# Altium schematic sheet EVB-ANNA-B5_SCHEM_0005_On-Board-Debug.SchDoc
size A3; DocumentNumber: 5; SheetNumber: 6; SheetTotal: 8
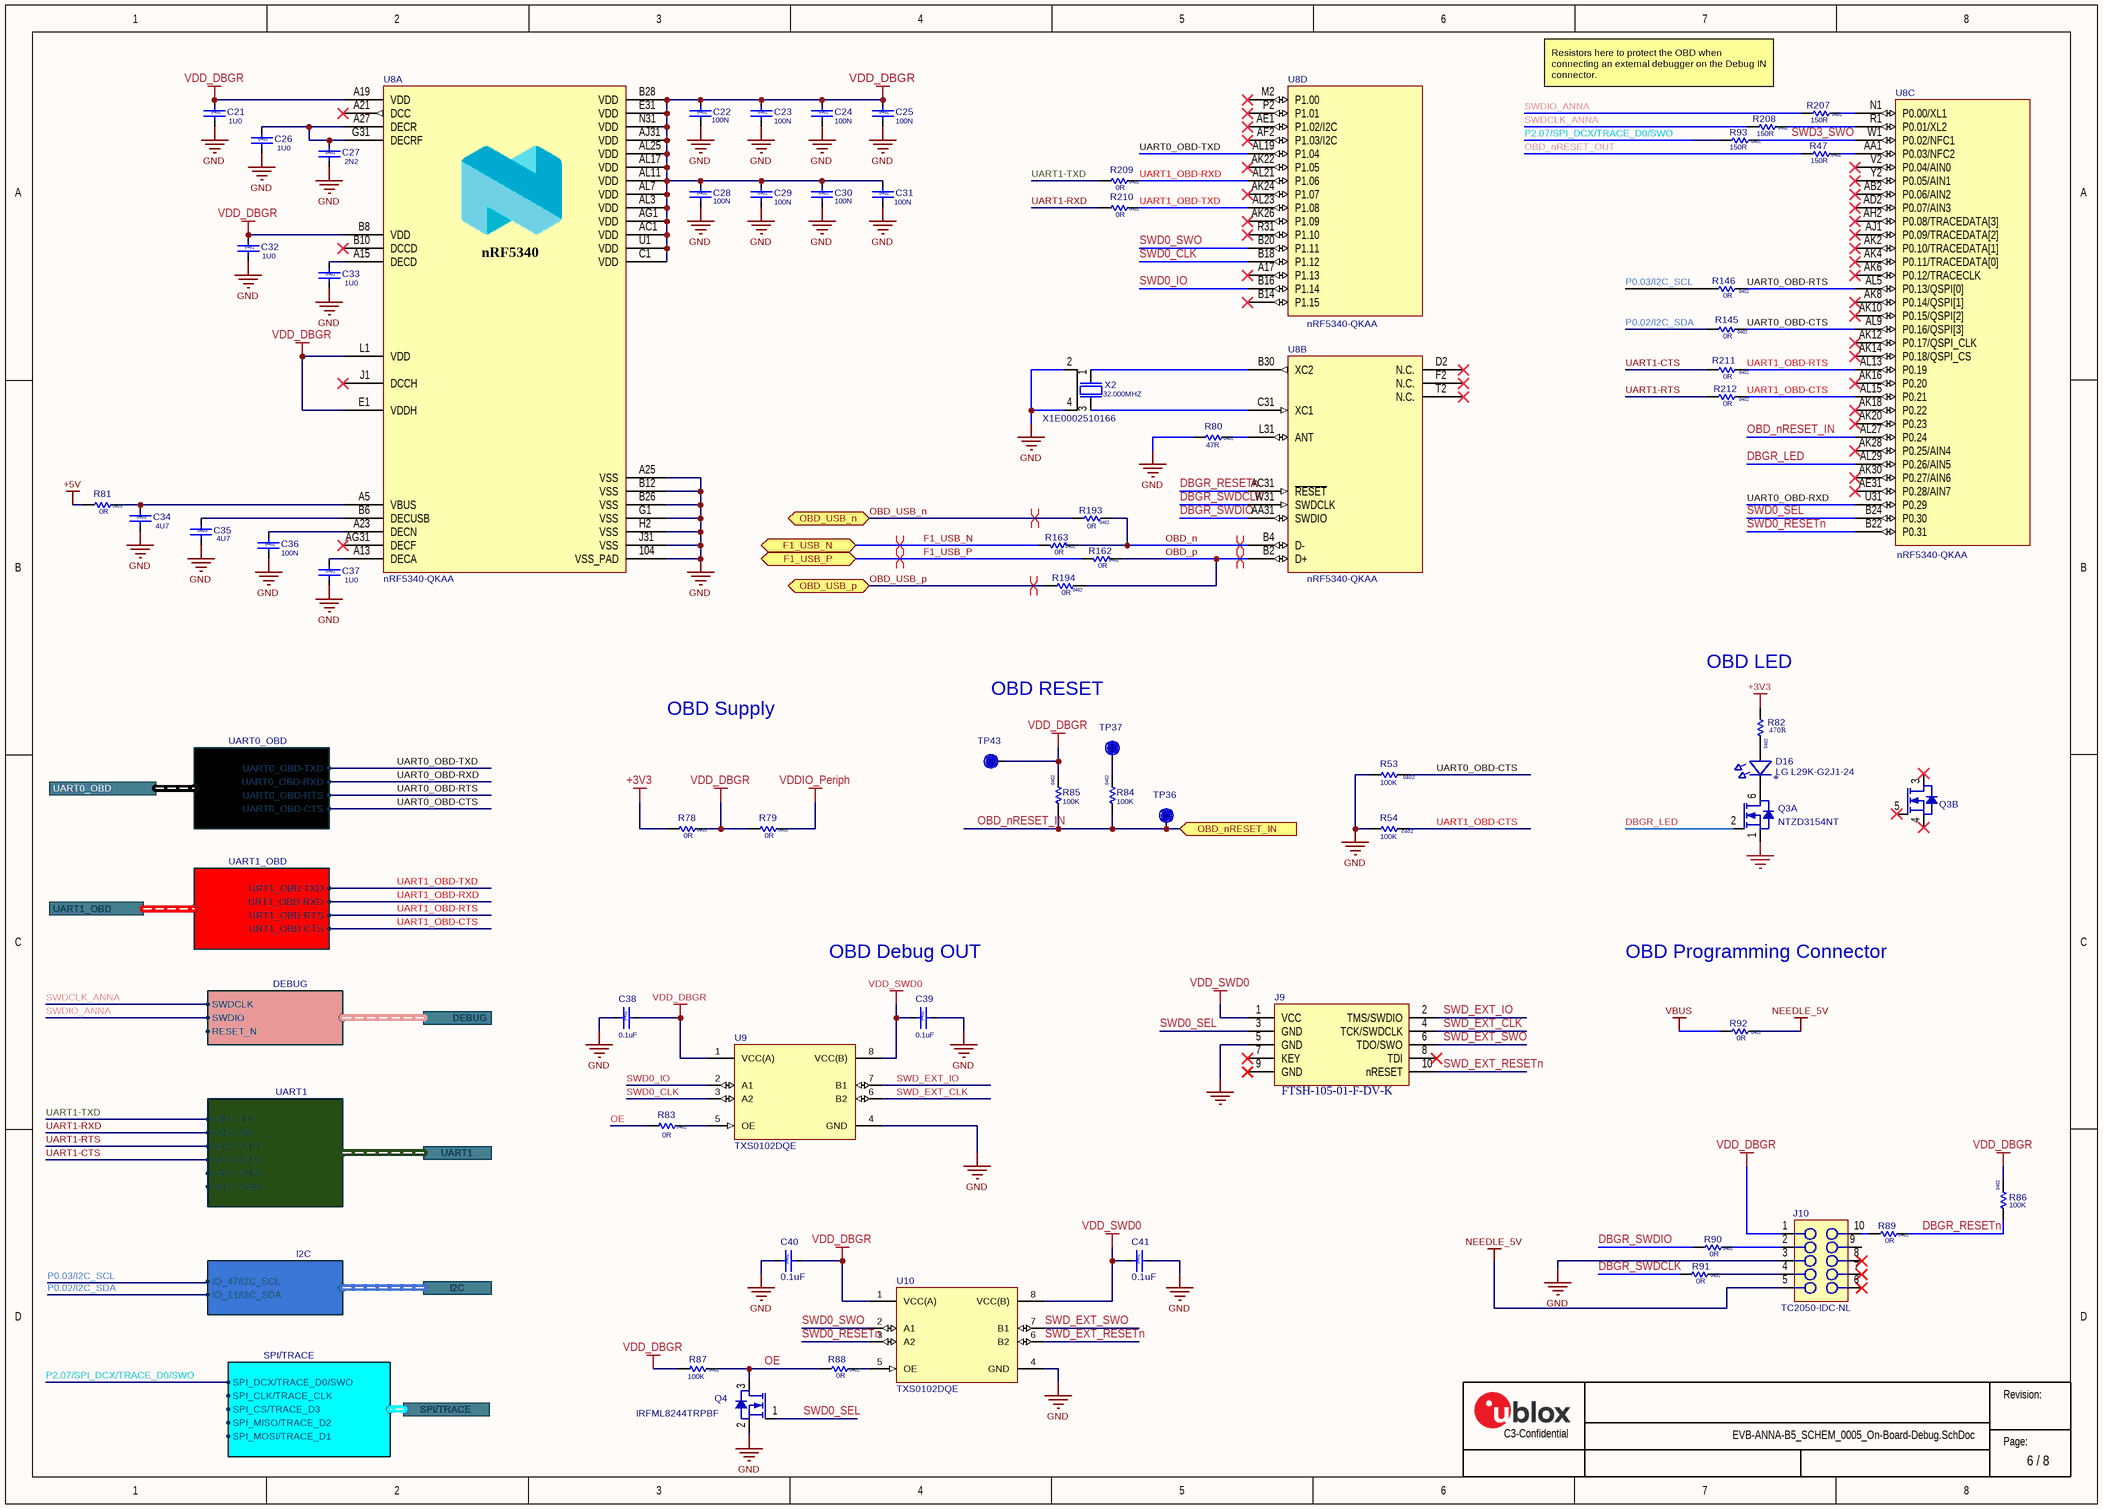
[diagram p0: EVB-ANNA-B5_SCHEM_0005_On-Board-Debug.SchDoc]

## Parts
C21  value 1U0  Size: 0402  [Cap_0402_1100Lx600Wx600H_600x600Pad_350G_FLX]  (hidden comment: UBXH01-2021003)
C22  value 100N  Size: 0402  [Cap 0402 HD]  (hidden comment: UBXH01-2021002)
C23  value 100N  Size: 0402  [Cap 0402 HD]  (hidden comment: UBXH01-2021002)
C24  value 100N  Size: 0402  [Cap 0402 HD]  (hidden comment: UBXH01-2021002)
C25  value 100N  Size: 0402  [Cap 0402 HD]  (hidden comment: UBXH01-2021002)
C26  value 1U0  Size: 0402  [Cap_0402_1100Lx600Wx600H_600x600Pad_350G_FLX]  (hidden comment: UBXH01-2021003)
C27  value 2N2  Size: 0402  [Cap_0402_1100Lx600Wx600H_600x600Pad_350G_FLX]  (hidden comment: UBXH01-0023017)
C28  value 100N  Size: 0402  [Cap 0402 HD]  (hidden comment: UBXH01-2021002)
C29  value 100N  Size: 0402  [Cap 0402 HD]  (hidden comment: UBXH01-2021002)
C30  value 100N  Size: 0402  [Cap 0402 HD]  (hidden comment: UBXH01-2021002)
C31  value 100N  Size: 0402  [Cap 0402 HD]  (hidden comment: UBXH01-2021002)
C32  value 1U0  Size: 0402  [Cap_0402_1100Lx600Wx600H_600x600Pad_350G_FLX]  (hidden comment: UBXH01-2021003)
C33  value 1U0  Size: 0402  [Cap_0402_1100Lx600Wx600H_600x600Pad_350G_FLX]  (hidden comment: UBXH01-2021003)
C34  value 4U7  Size: 0603  [CAP_0603_1750Lx950Wx850H_600x1000Pad_900G_FLX]  (hidden comment: UBXH01-2002003)
C35  value 4U7  Size: 0603  [CAP_0603_1750Lx950Wx850H_600x1000Pad_900G_FLX]  (hidden comment: UBXH01-2002003)
C36  value 100N  Size: 0402  [Cap 0402 HD]  (hidden comment: UBXH01-2021002)
C37  value 1U0  Size: 0402  [Cap_0402_1100Lx600Wx600H_600x600Pad_350G_FLX]  (hidden comment: UBXH01-2021003)
C38  value 0.1uF  Size: 0402  [Cap 0402 HD]  (hidden comment: 120-00016)
C39  value 0.1uF  Size: 0402  [Cap 0402 HD]  (hidden comment: 120-00016)
C40  value 0.1uF  Size: 0402  [Cap 0402 HD]  (hidden comment: 120-00016)
C41  value 0.1uF  Size: 0402  [Cap 0402 HD]  (hidden comment: 120-00016)
D16  Manufacturer P/N: LG L29K-G2J1-24  [LED_0603_1600Lx800Wx400H_600x800Pad_800G_FLX]  (hidden comment: UBXH11-0000018)
J9  Manufacturer P/N: FTSH-105-01-F-DV-K  [HDR.050P-10Pin-2x5-SMT_Key]  (hidden comment: 130-00099)
J10  TC2050-IDC-NL  [TC2050-IDC-NL]  (no BOM)
Q3  value NTZD3154NT  [SOT-563]  (hidden comment: UBXH20-0000083)  (parts A,B of 2)
Q4  value IRFML8244TRPBF  [SOT-23]  (hidden comment: UBXH20-0000036)
R47  value 150R  Size: 0402  [RES_0402_1100Lx600Wx400H_500x600Pad_400G_FLX]  (hidden comment: UBXH18-0008029)
R53  value 100K  Size: 0402  [RES 0402 HD]  (hidden comment: UBXH18-0000005)
R54  value 100K  Size: 0402  [RES 0402 HD]  (hidden comment: UBXH18-0000005)
R78  value 0R  Size: 0603  [RES_0603_1700Lx950Wx600H_600x1000Pad_800G_FLX]  (hidden comment: UBXH18-0003001)
R79  value 0R  Size: 0603  [RES_0603_1700Lx950Wx600H_600x1000Pad_800G_FLX]  (hidden comment: UBXH18-0003001)
R80  value 47R  Size: 0402  [RES_0402_1100Lx600Wx400H_500x600Pad_400G_FLX]  (hidden comment: UBXH18-0008017)
R81  value 0R  Size: 0603  [RES_0603_1700Lx950Wx600H_600x1000Pad_800G_FLX]  (hidden comment: UBXH18-0003001)
R82  value 470R  Size: 0402  [RES_0402_1100Lx600Wx400H_500x600Pad_400G_FLX]  (hidden comment: UBXH18-0008041)
R83  value 0R  Size: 0402  [RES 0402 HD]  (hidden comment: UBXH18-0003002)
R84  value 100K  Size: 0402  [RES 0402 HD]  (hidden comment: UBXH18-0000005)
R85  value 100K  Size: 0402  [RES 0402 HD]  (hidden comment: UBXH18-0000005)
R86  value 100K  Size: 0402  [RES 0402 HD]  (hidden comment: UBXH18-0000005)
R87  value 100K  Size: 0402  [RES 0402 HD]  (hidden comment: UBXH18-0000005)
R88  value 0R  Size: 0402  [RES 0402 HD]  (hidden comment: UBXH18-0003002)
R89  value 0R  Size: 0402  [RES 0402 HD]  (hidden comment: UBXH18-0003002)
R90  value 0R  Size: 0402  [RES 0402 HD]  (hidden comment: UBXH18-0003002)
R91  value 0R  Size: 0402  [RES 0402 HD]  (hidden comment: UBXH18-0003002)
R92  value 0R  Size: 0402  [RES 0402 HD]  (hidden comment: UBXH18-0003002)
R93  value 150R  Size: 0402  [RES_0402_1100Lx600Wx400H_500x600Pad_400G_FLX]  (hidden comment: UBXH18-0008029)
R145  value 0R  Size: 0402  [RES 0402 HD]  (hidden comment: UBXH18-0003002)
R146  value 0R  Size: 0402  [RES 0402 HD]  (hidden comment: UBXH18-0003002)
R162  value 0R  Size: 0402  [RES 0402 HD]  (hidden comment: UBXH18-0003002)
R163  value 0R  Size: 0402  [RES 0402 HD]  (hidden comment: UBXH18-0003002)
R193  value 0R  Size: 0402  [RES 0402 HD]  (hidden comment: UBXH18-0003002)
R194  value 0R  Size: 0402  [RES 0402 HD]  (hidden comment: UBXH18-0003002)
R207  value 150R  Size: 0402  [RES_0402_1100Lx600Wx400H_500x600Pad_400G_FLX]  (hidden comment: UBXH18-0008029)
R208  value 150R  Size: 0402  [RES_0402_1100Lx600Wx400H_500x600Pad_400G_FLX]  (hidden comment: UBXH18-0008029)
R209  value 0R  Size: 0402  [RES 0402 HD]  (hidden comment: UBXH18-0003002)
R210  value 0R  Size: 0402  [RES 0402 HD]  (hidden comment: UBXH18-0003002)
R211  value 0R  Size: 0402  [RES 0402 HD]  (hidden comment: UBXH18-0003002)
R212  value 0R  Size: 0402  [RES 0402 HD]  (hidden comment: UBXH18-0003002)
TP36  TP10R  [TP10R]  (value not drawn)  (no BOM)
TP37  TP10R  [TP10R]  (value not drawn)  (no BOM)
TP43  TP10R  [TP10R]  (value not drawn)  (no BOM)
U8  Manufacturer P/N: nRF5340-QKAA  [nRF5340_AQFN94]  (hidden comment: UBXH12-0000420)  (parts A,B,C,D of 4)
U9  value TXS0102DQE  [DQE0008A]  (hidden comment: UBXH10-0000108)
U10  value TXS0102DQE  [DQE0008A]  (hidden comment: UBXH10-0000108)
X2  value 32.000MHZ  Manufacturer P/N: X1E0002510166  [XTAL_1612]  (hidden comment: UBXH21-0000240)

## Ports
DEBUG (harness Debug), F1_USB_N (bidir), F1_USB_P (bidir), I2C (harness I2C), OBD_nRESET_IN (in), OBD_USB_n (bidir), OBD_USB_p (bidir), SPI/TRACE (harness SPI/TRACE), UART0_OBD (harness UART0_OBD), UART1 (harness UART1), UART1_OBD (harness UART1_OBD)

## Harnesses
UART1_OBD: URT1_OBD-RTS, URT1_OBD-CTS, URT1_OBD-TXD, URT1_OBD-RXD
UART0_OBD: UART0_OBD-TXD, UART0_OBD-RXD, UART0_OBD-RTS, UART0_OBD-CTS
DEBUG: RESET_N, SWDIO, SWDCLK
UART1: URT1-RTS, URT1-CTS, URT1-TX, URT1-RX, URT1-DTR, URT1-DSR
SPI/TRACE: SPI_DCX/TRACE_D0/SWO, SPI_CLK/TRACE_CLK, SPI_CS/TRACE_D3, SPI_MISO/TRACE_D2, SPI_MOSI/TRACE_D1
I2C: IO_47/I2C_SCL, IO_11/I2C_SDA

## Nets
+3V3: R78.1 R82.1
+5V: R81.1
GND: C21.2 C22.2 C23.2 C24.2 C25.2 C26.2 C27.2 C28.2 C29.2 C30.2 C31.2 C32.2 C33.2 C34.2 C35.2 C36.2 C37.2 C38.1 C39.2 C40.1 C41.2 J9.5(GND) J10.3 Q3.1(S1) Q4.2(S) R53.1 R54.1 R80.1 U8.104(VSS_PAD) U8.A25(VSS) U8.B12(VSS) U8.B26(VSS) U8.G1(VSS) U8.H2(VSS) U8.J31(VSS) U9.4(GND) U10.4(GND) X2.2 X2.4
NEEDLE_5V: J10.5 R92.1
VBUS: R92.2
VDD_DBGR: C21.1 C22.1 C23.1 C24.1 C25.1 C28.1 C29.1 C30.1 C31.1 C32.1 C38.2 C40.2 J10.1 R78.2 R79.1 R85.2 R86.2 R87.2 TP43.1 U8.A19(VDD) U8.AC1(VDD) U8.AG1(VDD) U8.AJ31(VDD) U8.AL3(VDD) U8.AL7(VDD) U8.AL11(VDD) U8.AL17(VDD) U8.AL25(VDD) U8.B8(VDD) U8.B28(VDD) U8.C1(VDD) U8.E1(VDDH) U8.E31(VDD) U8.L1(VDD) U8.N31(VDD) U8.U1(VDD) U9.1(VCC(A)) U10.1(VCC(A))
VDD_SWD0: C39.1 C41.1 J9.1(VCC) U9.8(VCC(B)) U10.8(VCC(B))
VDDIO_Periph: R79.2
DBGR_LED: Q3.2(G1) U8.AL29(P0.26/AIN5)
DBGR_RESETn: R86.1 R89.1 U8.AC31(~{RESET})
DBGR_SWDCLK: R91.2 U8.W31(SWDCLK)
DBGR_SWDIO: R90.2 U8.AA31(SWDIO)
F1_USB_N: R163.2 ; port F1_USB_N
F1_USB_P: R162.2 ; port F1_USB_P
OBD_n: R163.1 R193.1 U8.B4(D-)
OBD_nRESET_IN: R84.1 R85.1 TP36.1 U8.AL27(P0.24) ; port OBD_nRESET_IN
OBD_nRESET_OUT: R47.1
OBD_p: R162.1 R194.1 U8.B2(D+)
OBD_USB_n: R193.2 ; port OBD_USB_n
OBD_USB_p: R194.2 ; port OBD_USB_p
OE: Q4.3(D) R83.2 R87.1 R88.1
P0.02/I2C_SDA: R145.2 ; port I2C.IO_11/I2C_SDA
P0.03/I2C_SCL: R146.2 ; port I2C.IO_47/I2C_SCL
P2.07/SPI_DCX/TRACE_D0/SWO: R93.1 ; port SPI/TRACE.SPI_DCX/TRACE_D0/SWO
SWD0_CLK: U8.B18(P1.12) U9.3(A2)
SWD0_IO: U8.B16(P1.14) U9.2(A1)
SWD0_RESETn: U8.B22(P0.31) U10.3(A2)
SWD0_SEL: J9.3(GND) Q4.1(G) U8.B24(P0.30)
SWD0_SWO: U8.B20(P1.11) U10.2(A1)
SWD3_SWO: R93.2 U8.W1(P0.02/NFC1)
SWD_EXT_CLK: J9.4(TCK/SWDCLK) U9.6(B2)
SWD_EXT_IO: J9.2(TMS/SWDIO) U9.7(B1)
SWD_EXT_RESETn: J9.10(nRESET) U10.6(B2)
SWD_EXT_SWO: J9.6(TDO/SWO) U10.7(B1)
SWDCLK_ANNA: R208.1 ; port DEBUG.SWDCLK
SWDIO_ANNA: R207.1 ; port DEBUG.SWDIO
UART0_OBD-CTS: R53.2 R145.1 U8.AL9(P0.16/QSPI[3]) ; port UART0_OBD.UART0_OBD-CTS
UART0_OBD-RTS: R146.1 U8.AL5(P0.13/QSPI[0]) ; port UART0_OBD.UART0_OBD-RTS
UART0_OBD-RXD: U8.U31(P0.29) ; port UART0_OBD.UART0_OBD-RXD
UART0_OBD-TXD: U8.AL19(P1.04) ; port UART0_OBD.UART0_OBD-TXD
UART1-CTS: R211.2 ; port UART1.URT1-CTS
UART1-RTS: R212.2 ; port UART1.URT1-RTS
UART1-RXD: R210.2 ; port UART1.URT1-RX
UART1-TXD: R209.2 ; port UART1.URT1-TX
UART1_OBD-CTS: R54.2 R212.1 U8.AL15(P0.21) ; port UART1_OBD.URT1_OBD-CTS
UART1_OBD-RTS: R211.1 U8.AL13(P0.19) ; port UART1_OBD.URT1_OBD-RTS
UART1_OBD-RXD: R209.1 U8.AL21(P1.06) ; port UART1_OBD.URT1_OBD-RXD
UART1_OBD-TXD: R210.1 U8.AL23(P1.08) ; port UART1_OBD.URT1_OBD-TXD
NetC26_1: C26.1 C27.1 U8.A27(DECR) U8.G31(DECRF)
NetC33_1: C33.1 U8.A15(DECD)
NetC34_1: C34.1 R81.2 U8.A5(VBUS)
NetC35_1: C35.1 U8.B6(DECUSB)
NetC36_1: C36.1 U8.A23(DECN)
NetC37_1: C37.1 U8.A13(DECA)
NetD16_1: D16.1(C) Q3.6(D1)
NetD16_2: D16.2(A) R82.2
NetJ10_2: J10.2 R90.1
NetJ10_4: J10.4 R91.1
NetJ10_10: J10.10 R89.2
NetR47_2: R47.2 U8.AA1(P0.03/NFC2)
NetR80_2: R80.2 U8.L31(ANT)
NetR83_1: R83.1 U9.5(OE)
NetR84_2: R84.2 TP37.1
NetR88_2: R88.2 U10.5(OE)
NetR207_2: R207.2 U8.N1(P0.00/XL1)
NetR208_2: R208.2 U8.R1(P0.01/XL2)
NetU8_B30: U8.B30(XC2) X2.1
NetU8_C31: U8.C31(XC1) X2.3

Not connected (* = marked no-connect by the designer): J9 7(KEY)* 8(TDI)* 9(GND)*; J10 6* 7* 8* 9; Q3 3(D2)* 4(S2)* 5(G2)*; U8 A17(P1.13)* A21(DCC)* AB2(P0.06/AIN2)* AD2(P0.07/AIN3)* AE1(P1.02/I2C)* AE31(P0.28/AIN7)* AF2(P1.03/I2C)* AG31(DECF)* AH2(P0.08/TRACEDATA[3])* AJ1(P0.09/TRACEDATA[2])* AK2(P0.10/TRACEDATA[1])* AK4(P0.11/TRACEDATA[0])* AK6(P0.12/TRACECLK)* AK8(P0.14/QSPI[1])* AK10(P0.15/QSPI[2])* AK12(P0.17/QSPI_CLK)* AK14(P0.18/QSPI_CS)* AK16(P0.20)* AK18(P0.22)* AK20(P0.23)* AK22(P1.05)* AK24(P1.07)* AK26(P1.09)* AK28(P0.25/AIN4)* AK30(P0.27/AIN6)* B10(DCCD)* B14(P1.15)* D2(N.C.)* F2(N.C.)* J1(DCCH)* M2(P1.00)* P2(P1.01)* R31(P1.10)* T2(N.C.)* V2(P0.04/AIN0)* Y2(P0.05/AIN1)*

## Layout directives
differential pair; net class USB_DIFF: F1_USB_N, F1_USB_P
differential pair: OBD_n, OBD_p, OBD_USB_n, OBD_USB_p

## Notes on the sheet
- Resistors here to protect the OBD when connecting an external debugger on the Debug IN connector.
- OBD Supply
- OBD RESET
- (near R82) OBD LED
- OBD Debug OUT
- OBD Programming Connector
- Revision:
- C3-Confidential
- Page:
- (in symbol UBXH12-0000420, part A) nRF5340

## Library data of the parts
C21 C26 C32 C33 C37 = UBXH01-2021003: CAP CER X5R 0402 1U0 10% 6.3V; Manufacturer: Murata Manufacturing Company, Ltd.; Manufacturer P/N: GRM155R61C105KA12; Editor: philippe.largier; Released by: alvaro.nussbaum; Env: GREEN; Permitted Use: Volume Products; Perferred: PREF; Mfg P/N Status: Active; Mfg P/N Split: 100; Mfg P/N Released: Yes; Part Number: UBXH01-2021003; Tolerance: 10%; Max Voltage: 6.3V; Part Type: Capacitor; Release Data: 2016-02-02T16:25:07; UBX Wiki: https://wiki.u-blox.com/bin/view/Operations/PartDetails?index=5761; RefDes: C; Mfg P/N Datasheet: https://wiki.u-blox.com/bin/view/Generic/Docs/DocumentSummary?index=29581; Manufacturer 2: Samsung Electro-Mechanics; Manufacturer P/N 2: CL05A105KA5NNN; Mfg P/N Status 2: Active; Mfg P/N Split 2: 0; Mfg P/N Released 2: Yes; Mfg P/N Datasheet 2: https://wiki.u-blox.com/bin/view/Generic/Docs/DocumentSummary?index=28197; Manufacturer 3: Taiyo Yuden Company, Ltd.; Manufacturer P/N 3: JMK105BJ105KV-F; Mfg P/N Status 3: NRND; Mfg P/N Split 3: 0; Mfg P/N Released 3: Yes; Mfg P/N Datasheet 3: https://wiki.u-blox.com/bin/view/Generic/Docs/DocumentSummary?index=20234
C22-C25 C28-C31 C36 = UBXH01-2021002: CAP CER X5R 0402 100N 10% 10V; Manufacturer: Murata Manufacturing Company, Ltd.; Manufacturer P/N: GRM155R61A104KA01; Editor: roland.rust; Env: GREEN; Permitted Use: Volume Products; Perferred: PREF; Mfg P/N Status: NRND; Mfg P/N Split: 100; Mfg P/N Released: Yes; Part Number: UBXH01-2021002; Tolerance: 10%; Max Voltage: 10V; Part Type: Capacitor; Released by: roland.rust; Release Data: 2005-07-22T13:59:44; UBX Wiki: https://wiki.u-blox.com/bin/view/Operations/PartDetails?index=5759; RefDes: C; Manufacturer 2: Samsung Electro-Mechanics; Manufacturer P/N 2: CL05A104KP5NNN; Mfg P/N Status 2: Active; Mfg P/N Split 2: 0; Mfg P/N Released 2: Yes; Mfg P/N Datasheet 2: https://wiki.u-blox.com/bin/view/Generic/Docs/DocumentSummary?index=28113
C27 = UBXH01-0023017: CAP CER X7R 0402 2N2 10% 16V; Manufacturer: Murata Manufacturing Company, Ltd.; Manufacturer P/N: GRM155R71C222KA01; Editor: roland.rust; Env: ROHS; Permitted Use: Volume Products; Perferred: PREF; Mfg P/N Status: NRND; Mfg P/N Split: 100; Mfg P/N Released: Yes; Part Number: UBXH01-0023017; Tolerance: 10%; Max Voltage: 16V; Part Type: Capacitor; Released by: roland.rust; Release Data: 2005-07-22T13:59:44; UBX Wiki: https://wiki.u-blox.com/bin/view/Operations/PartDetails?index=5475; RefDes: C
C34 C35 = UBXH01-2002003: CAP CER X5R 0603 4U7 10% 6.3V; Manufacturer: Murata Manufacturing Company, Ltd.; Manufacturer P/N: GRM188R61C475KE11; Editor: philippe.largier; Released by: roland.rust; Env: GREEN; Permitted Use: Volume Products; Perferred: PREF; Mfg P/N Status: Active; Mfg P/N Split: 100; Mfg P/N Released: Yes; Part Number: UBXH01-2002003; Tolerance: 10%; Max Voltage: 6.3V; Part Type: Capacitor; Release Data: 2016-02-02T16:39:45; UBX Wiki: https://wiki.u-blox.com/bin/view/Operations/PartDetails?index=5742; RefDes: C; Mfg P/N Datasheet: https://wiki.u-blox.com/bin/view/Generic/Docs/DocumentSummary?index=30154; Manufacturer 2: Murata Manufacturing Company, Ltd.; Manufacturer P/N 2: GRM188R61E475KE11; Mfg P/N Status 2: Active; Mfg P/N Split 2: 0; Mfg P/N Released 2: Yes; Mfg P/N Datasheet 2: https://wiki.u-blox.com/bin/view/Generic/Docs/DocumentSummary?index=30500; Manufacturer 3: Samsung Electro-Mechanics; Manufacturer P/N 3: CL10A475KO8NNN; Mfg P/N Status 3: NRND; Mfg P/N Split 3: 0; Mfg P/N Released 3: Yes; Mfg P/N Datasheet 3: https://wiki.u-blox.com/bin/view/Generic/Docs/DocumentSummary?index=28177
C38-C41 = 120-00016: Cap, Ceramic 0.1uF 10V 10% X5R 0402; Part Name: CAP CER 0.1UF 10V 10% X5R 0402; Part_Type: Ceramic Capacitor; Manufacturer: Murata Electronics North America; Manufacturer P/N: GRM155R61A104KA01J; Item_Phase: Production; Component Mounting Type: SMT; Tolerance: +/- 10%; Use in new designs: Yes; Part Number: 120-00016; Revision: 0A; Supplier 1: Digi-Key; Supplier Part Number 1: 490-6297-1-ND; Manufacturer 2: Yageo; Manufacturer P/N 2: CC0402KRX5R6BB104; Supplier 2: Digi-Key; Supplier Part Number 2: 311-1336-1-ND; Arena Link: https://app.bom.com/a/GYHPV2L2L43KRMBK?v=spec.summary; Height: 0.55mm; Pins: 2; Temperature Coefficient: X5R; Voltage: 10V
D16 = UBXH11-0000018: LED CHIP 0603 LOW CURRENT OSRAM 0.002A GREEN 2.2V 2mA; Editor: johann.furrer; Released by: martin.grasse; Env: ROHS; Permitted Use: Volume Products; Perferred: PREF; Mfg P/N Status: NRND; Mfg P/N Split: 100; Mfg P/N Released: Yes; Color: *; Part Number: UBXH11-0000018; Value: GREEN; Max Voltage: 2.2V; Max Current: 2mA; Size: 0603; Min Operating Temp: -40°C; Max Operating Temp: 85°C; Part Type: LED; Release Data: 2018-01-09T15:31:38; UBX Wiki: https://wiki.u-blox.com/bin/view/Operations/PartDetails?index=20619; RefDes: DS; Manufacturer: Osram; Mfg P/N Datasheet: https://wiki.u-blox.com/bin/view/Generic/Docs/DocumentSummary?index=20620
J9 = 130-00099: Header 0.05" 10Pin 2Row SMD Black; Part Name: CON HDR 0.05" 10Pin 2Row SMD Black; Part_Type: Connector; Manufacturer: Samtec; Item_Phase: Pre-Production; Component Mounting Type: SMT; Keyed: Yes; Locking: No; Pin Pitch: 0.050"; Rows: 2; Part Number: 130-00099; Revision: 1; Supplier 1: Digi-Key; Supplier Part Number 1: SAM8796-ND; Arena Link: https://app.bom.com/a/5N6EKRARATS7TSHL?v=spec.summary; Color: Black; Connector Type: Header; Height: 6mm; Length: 12.75mm; Pins: 10; Use in new designs: Yes; Width: 4.78
J10 = TC2050-IDC-NL: CON PADS FOR CBL PLUG-OF-NAILS 10-PIN NO LEGS; Manufacturer: TAG Connect; Added By: Paul B; Manufacturer P/N: TC2050-IDC-NL; Part Number: TC2050-IDC-NL; Size: 6.1mm x 9.9mm; Height: 0; DNP: DNP; Added Date: 12/3/2015
Q3 = UBXH20-0000083: DUAL N-CHANNEL SMALL SIGNAL MOSFET SOT-563-6 PACKAGE; Manufacturer: ON Semiconductor; Editor: pierpaolo.arban; Released by: matej.budin; Env: ROHS; Permitted Use: Support Products; Perferred: PREF; Mfg P/N Status: Active; Mfg P/N Split: 100; Mfg P/N Released: Yes; Part Number: UBXH20-0000083; Min Operating Temp: -55°C; Max Operating Temp: 155°C; Part Type: Transistor; Release Data: 2023-01-26T11:57:34; UBX Wiki: https://wiki.u-blox.com/bin/view/Operations/PartDetails?index=37715; RefDes: Q; Manufacturer P/N: NTZD3154NT; Mfg P/N Datasheet: https://wiki.u-blox.com/bin/view/Generic/Docs/DocumentSummary?index=37718
Q4 = UBXH20-0000036: N-CHANNEL 25V HEXFET SOT23 25V 5.8A; Manufacturer: IR International Rectifier; Editor: martin.kessel; Env: ROHS; Permitted Use: Internal Use; Perferred: PREF; Mfg P/N Status: Active; Mfg P/N Split: 100; Mfg P/N Released: No; Part Number: UBXH20-0000036; Max Voltage: 25V; Max Current: 5.8A; Min Operating Temp: -55°C; Max Operating Temp: 125°C; Part Type: Transistor; UBX Wiki: https://wiki.u-blox.com/bin/view/Operations/PartDetails?index=20556; RefDes: Q; Manufacturer P/N: IRFML8244TRPBF; Mfg P/N Datasheet: https://wiki.u-blox.com/bin/view/Generic/Docs/DocumentSummary?index=20559
R47 R93 R207 R208 = UBXH18-0008029: RES THICK FILM CHIP 0402 150R 5% 63mW; Manufacturer: KOA; Manufacturer P/N: RK73B1ETTP151J; Editor: par.hakansson; Released by: adam.johansson; Env: ROHS; Permitted Use: Volume Products; Perferred: PREF; Mfg P/N Status: Active; Mfg P/N Split: 100; Mfg P/N Released: Yes; Part Number: UBXH18-0008029; Tolerance: 5%; Max Power: 63mW; Part Type: Resistor; Release Data: 2015-11-05T14:33:12; UBX Wiki: https://wiki.u-blox.com/bin/view/Operations/PartDetails?index=6908; RefDes: R; Case/Package: 0x0y; Min Operating Temp: -55°C; Max Operating Temp: 125°C; Mfg P/N Datasheet: https://wiki.u-blox.com/bin/view/Generic/Docs/DocumentSummary?index=4543
R53 R54 R84-R87 = UBXH18-0000005: RES THICK FILM CHIP 0402 100K 1% 63mW; Manufacturer: KOA; Manufacturer P/N: RK73H1ETTP1003F; Editor: dario.antonaz; Released by: sandro.sestan; Env: ROHS; Permitted Use: Volume Products; Mfg P/N Status: Active; Mfg P/N Split: 100; Mfg P/N Released: Yes; Part Number: UBXH18-0000005; Tolerance: 1%; Max Power: 63mW; Part Type: Resistor; Release Data: 2009-11-30T11:05:22; UBX Wiki: https://wiki.u-blox.com/bin/view/Operations/PartDetails?index=8114; Perferred: N/A; RefDes: R; Mfg P/N Datasheet: https://wiki.u-blox.com/bin/view/Generic/Docs/DocumentSummary?index=8222; Mfg P/N Split 2: 0; Mfg P/N Released 2: Yes
  R53: Case/Package: 0x0y; Manufacturer 2: YAGEO; Manufacturer P/N 2: RC0402FR-07100KL; Mfg P/N Status 2: Active; Mfg P/N Datasheet 2: https://wiki.u-blox.com/bin/view/Generic/Docs/DocumentSummary?index=29373; Manufacturer 3: ROHM; Manufacturer P/N 3: MCR01MZPF1003; Mfg P/N Status 3: Obsolete; Mfg P/N Split 3: 0; Mfg P/N Released 3: Yes; Mfg P/N Datasheet 3: https://wiki.u-blox.com/bin/view/Generic/Docs/DocumentSummary?index=8186
  R54: Manufacturer 2: YAGEO; Manufacturer P/N 2: RC0402FR-07100KL; Mfg P/N Status 2: Active; Case/Package: 0x0y; Mfg P/N Datasheet 2: https://wiki.u-blox.com/bin/view/Generic/Docs/DocumentSummary?index=29373; Manufacturer 3: ROHM; Manufacturer P/N 3: MCR01MZPF1003; Mfg P/N Status 3: Obsolete; Mfg P/N Split 3: 0; Mfg P/N Released 3: Yes; Mfg P/N Datasheet 3: https://wiki.u-blox.com/bin/view/Generic/Docs/DocumentSummary?index=8186
  R84-R87: Manufacturer 2: ROHM; Manufacturer P/N 2: MCR01MZPF1003; Mfg P/N Status 2: Obsolete; Mfg P/N Datasheet 2: https://wiki.u-blox.com/bin/view/Generic/Docs/DocumentSummary?index=8186
R78 R79 R81 = UBXH18-0003001: RES THICK FILM CHIP 0603 0R 0 100mW; Manufacturer: YAGEO; Manufacturer P/N: RC0603JR-070RL; Tolerance: 0; Editor: martin.frauchiger; Env: ROHS; Permitted Use: Volume Products; Perferred: PREF; Mfg P/N Status: Active; Mfg P/N Split: 100; Mfg P/N Released: Yes; Part Number: UBXH18-0003001; Max Power: 100mW; Part Type: Resistor; Released by: martin.frauchiger; Release Data: 2005-07-14T10:55:51; UBX Wiki: https://wiki.u-blox.com/bin/view/Operations/PartDetails?index=6609; RefDes: R
R80 = UBXH18-0008017: RES THICK FILM CHIP 0402 47R 5% 100mW; Manufacturer: YAGEO; Manufacturer P/N: 2322_705_87479_L; Editor: roland.rust; Env: ROHS; Permitted Use: Volume Products; Perferred: PREF; Mfg P/N Status: Obsolete; Mfg P/N Split: 100; Mfg P/N Released: Yes; Part Number: UBXH18-0008017; Tolerance: 5%; Max Power: 100mW; Part Type: Resistor; Released by: roland.rust; Release Data: 2007-01-03T17:15:04; UBX Wiki: https://wiki.u-blox.com/bin/view/Operations/PartDetails?index=6891; RefDes: R; Manufacturer 2: YAGEO; Manufacturer P/N 2: RC0402JR-0747RL; Mfg P/N Status 2: Active; Mfg P/N Split 2: 0; Mfg P/N Released 2: No; Mfg P/N Datasheet 2: https://wiki.u-blox.com/bin/view/Generic/Docs/DocumentSummary?index=8163
R82 = UBXH18-0008041: RES THICK FILM CHIP 0402 470R 5% 100mW; Manufacturer: KOA; Manufacturer P/N: RK73B1ETTP471J; Editor: roland.rust; Env: ROHS; Permitted Use: Volume Products; Perferred: PREF; Mfg P/N Status: Active; Mfg P/N Split: 100; Mfg P/N Released: Yes; Part Number: UBXH18-0008041; Tolerance: 5%; Max Power: 100mW; Part Type: Resistor; Released by: roland.rust; Release Data: 2009-04-24T14:36:39; UBX Wiki: https://wiki.u-blox.com/bin/view/Operations/PartDetails?index=6926; RefDes: R; Manufacturer 2: ROHM; Manufacturer P/N 2: MCR01MZPJ471; Mfg P/N Status 2: Obsolete; Mfg P/N Split 2: 0; Mfg P/N Released 2: Yes; Manufacturer 3: YAGEO; Manufacturer P/N 3: 2322_705_87471_L; Mfg P/N Status 3: Obsolete; Mfg P/N Split 3: 0; Mfg P/N Released 3: Yes
R83 R88-R92 R162 R163 = UBXH18-0003002: RES THICK FILM CHIP 0402 0R 0 100mW; Manufacturer: KOA; Manufacturer P/N: RK73Z1ETTP; Tolerance: 0; Editor: charlotte.biber; Released by: peter.mueller; Env: ROHS; Permitted Use: Volume Products; Perferred: PREF; Mfg P/N Status: NRND; Mfg P/N Split: 100; Mfg P/N Released: Yes; Part Number: UBXH18-0003002; Max Power: 100mW; Part Type: Resistor; Release Data: 2012-06-05 09:49:55.978616; UBX Wiki: https://wiki.u-blox.com/bin/view/Operations/PartDetails?index=6611; RefDes: R; Manufacturer 2: YAGEO; Manufacturer P/N 2: 2322_705_91001_L; Mfg P/N Status 2: NRND; Mfg P/N Split 2: 0; Mfg P/N Released 2: Yes
R145 R146 R193 R194 R209-R212 = UBXH18-0003002: RES THICK FILM CHIP 0402 0R 0 100mW; Manufacturer: KOA; Manufacturer P/N: RK73Z1ETTD; Tolerance: 0; Editor: charlotte.biber; Released by: peter.mueller; Env: ROHS; Permitted Use: Volume Products; Perferred: PREF; Mfg P/N Status: NRND; Mfg P/N Split: 100; Mfg P/N Released: Yes; Part Number: UBXH18-0003002; Max Power: 100mW; Part Type: Resistor; Release Data: 2012-06-05 09:49:55.978616; UBX Wiki: https://wiki.u-blox.com/bin/view/Operations/PartDetails?index=6611; RefDes: R; Manufacturer 2: YAGEO; Manufacturer P/N 2: 2322_705_91001_L; Mfg P/N Status 2: NRND; Mfg P/N Split 2: 0; Mfg P/N Released 2: Yes
TP36 TP37 TP43 = TP10R: Testpoint, Round 1.0mm Dia; Added By: Jeremy D; Part Number: TP10R; Size: 1.0mm; Height: 0; DNP: DNP; Added Date: 2/1/2015; Checked By: Paul B; Checked Date: 2/5/2015
U8 = UBXH12-0000420: BT5/802.15.4 SOC NORDIC NRF5340 2.4GHZ; Manufacturer: Nordic Semiconductor; Value: nRF5340-QKAA; Editor: cam.nichols; Released by: eric.moog; Single Source: Yes; Env: ROHS; Permitted Use: Volume Products; Perferred: PREF; Mfg P/N Status: Active; Mfg P/N Split: 100; ComponentLink1URL: *; ComponentLink1Description: Datasheet; ComponentLink2URL: *; ComponentLink2Description: Supplier link; Part Number: UBXH12-0000420; Min Operating Temp: -40°C; Max Operating Temp: 105°C; Part Type: RF-ASIC; Release Data: 2021-02-15T23:44:47; UBX Wiki: https://wiki.u-blox.com/bin/view/Operations/PartDetails?index=32860; RefDes: U; Mfg P/N Released: Yes; Mfg P/N Datasheet: https://wiki.u-blox.com/bin/view/Generic/Docs/DocumentSummary?index=32915
U9 U10 = UBXH10-0000108: TXS0102 2-BIT BIDIRECTIONAL VOLTAGE-LEVEL TRANSLATOR X2SON-8 TXS0102DQE 5.5V; Manufacturer 1: Texas Instruments; Manufacturer Part Number 1: TXS0102DQET; Body Size: 1.9mm x 0.9mm; Current: None; Item Phase: In Production; MFG Package: DSBGA-8; Use in new designs: Yes; Editor: eric.moog; Env: ROHS; Permitted Use: Support Products; Perferred: PREF; Mfg P/N Status: Active; Mfg P/N Split: 100; Mfg P/N Released: No; Part Number: UBXH10-0000108; Manufacturer 2: Texas Instruments; Manufacturer Part Number 2: TXS0102DQER; Height: 0.65mm; Max Operating Temp: 85°C; Min Operating Temp: -40°C; Part Name: TXS0102DQE; Pins: 8; Revision: 0A; Voltage: N/A; UBX Code: None; Max Voltage: 5.5V; Part Type: Interface; Single Source: Yes; UBX Wiki: https://wiki.u-blox.com/bin/view/Operations/PartDetails?index=39049; RefDes: U; Manufacturer: Texas Instruments; Manufacturer P/N: TXS0102DQE; Mfg P/N Datasheet: https://wiki.u-blox.com/bin/view/Generic/Docs/DocumentSummary?index=22177
X2 = UBXH21-0000240: CRYSTAL 32MHZ CL=8PF 1.6X1.2 MM 32.000MHZ +/-10PPM@25C+/-20PPM@-40/+85+/-1PPMAGEING; Manufacturer: TXC corporation; Editor: yaqin.chen; Released by: cam.nichols; Env: ROHS; Permitted Use: Volume Products; Perferred: PREF; Mfg P/N Status: Active; Mfg P/N Split: 100; Mfg P/N Released: Yes; Part Number: UBXH21-0000240; Tolerance: +/-10PPM@25C+/-20PPM@-40/+85+/-1PPMAGEING; Min Operating Temp: -40°C; Max Operating Temp: 85°C; Part Type: Crystal; Release Data: 2022-08-10T19:45:48; UBX Wiki: https://wiki.u-blox.com/bin/view/Operations/PartDetails?index=37290; RefDes: Y; Mfg P/N Datasheet: https://wiki.u-blox.com/bin/view/Generic/Docs/DocumentSummary?index=37320